# EAGLE design psu (EAGLE 7.6.0)
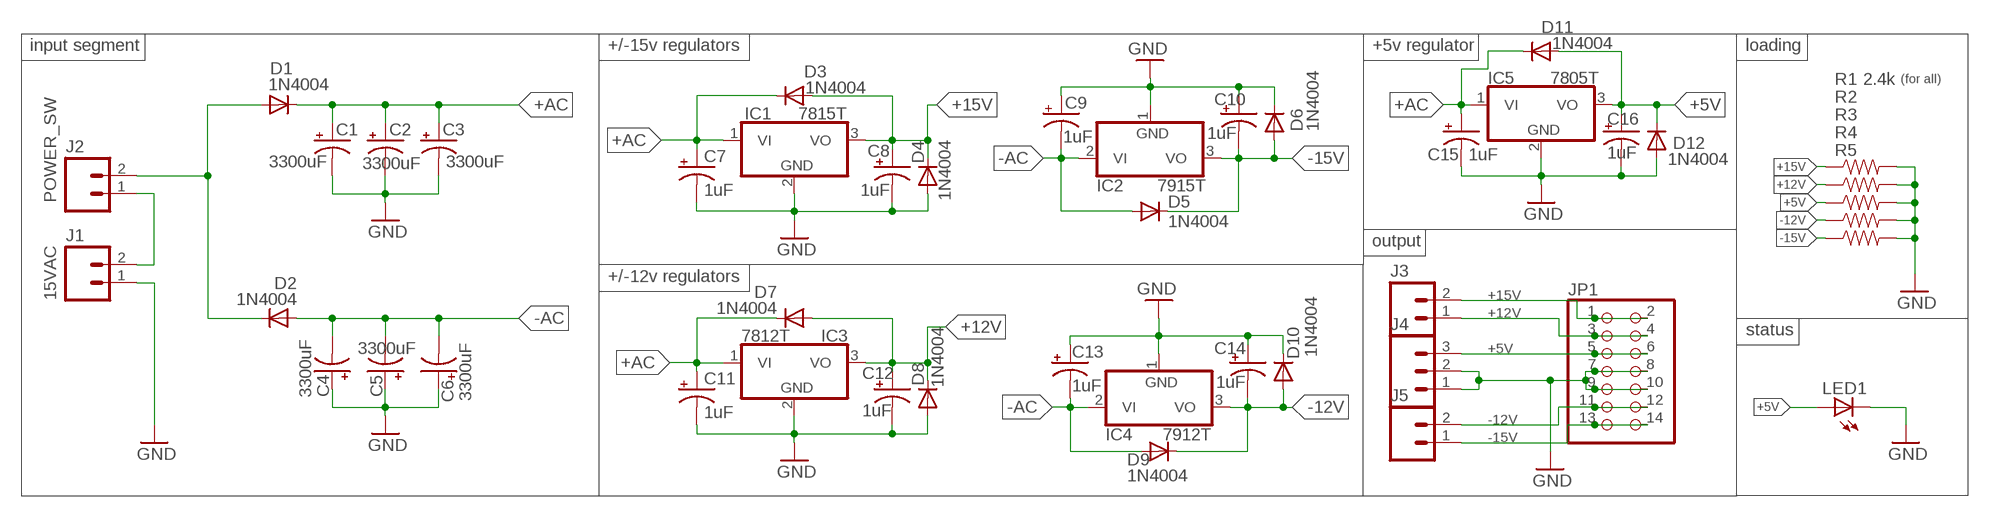
[diagram p0: schematic, sheet 1]

## Parts
C1  3300uF  CPOL-USE7.5-18  [E7,5-18]
C2  3300uF  CPOL-USE7.5-18  [E7,5-18]
C3  3300uF  CPOL-USE7.5-18  [E7,5-18]
C4  3300uF  CPOL-USE7.5-18  [E7,5-18]
C5  3300uF  CPOL-USE7.5-18  [E7,5-18]
C6  3300uF  CPOL-USE7.5-18  [E7,5-18]
C7  1uF  CPOL-USE2.5-5  [E2,5-5]
C8  1uF  CPOL-USE2.5-5  [E2,5-5]
C9  1uF  CPOL-USE2.5-5  [E2,5-5]
C10  1uF  CPOL-USE2.5-5  [E2,5-5]
C11  1uF  CPOL-USE2.5-5  [E2,5-5]
C12  1uF  CPOL-USE2.5-5  [E2,5-5]
C13  1uF  CPOL-USE2.5-5  [E2,5-5]
C14  1uF  CPOL-USE2.5-5  [E2,5-5]
C15  1uF  CPOL-USE2.5-5  [E2,5-5]
C16  1uF  CPOL-USE2.5-5  [E2,5-5]
D1  1N4004  [DO41-10]
D2  1N4004  [DO41-10]
D3  1N4004  [DO41-10]
D4  1N4004  [DO41-10]
D5  1N4004  [DO41-10]
D6  1N4004  [DO41-10]
D7  1N4004  [DO41-10]
D8  1N4004  [DO41-10]
D9  1N4004  [DO41-10]
D10  1N4004  [DO41-10]
D11  1N4004  [DO41-10]
D12  1N4004  [DO41-10]
IC1  7815T  [TO220H]
IC2  7915T  [TO220H]
IC3  7812T  [TO220H]
IC4  7912T  [TO220H]
IC5  7805T  [TO220H]
J1  15VAC  M025MM  [SCREWTERMINAL-5MM-2]
J2  POWER_SW  M025MM  [SCREWTERMINAL-5MM-2]
J3  M025MM  [SCREWTERMINAL-5MM-2]
J4  M03-SCREW-5MM  [SCREWTERMINAL-5MM-3]
J5  M025MM  [SCREWTERMINAL-5MM-2]
JP1  PINHD-2X7  [2X07]
LED1  LED3MM  [LED3MM]
R1  2.4k  RESISTOR0805-RES  [0805]
R2  2.4k  RESISTOR0805-RES  [0805]
R3  2.4k  RESISTOR0805-RES  [0805]
R4  2.4k  RESISTOR0805-RES  [0805]
R5  2.4k  RESISTOR0805-RES  [0805]

## Nets
+5V: C16.+ D11.A D12.C IC5.3(VO) J4.3 JP1.5 JP1.6 LED1.A R3.1
+12V: C12.+ D7.A D8.C IC3.3(VO) J3.1 JP1.3 JP1.4 R2.1
+15V: C8.+ D3.A D4.C IC1.3(VO) J3.2 JP1.1 JP1.2 R1.1
+AC: C1.+ C2.+ C3.+ C7.+ C11.+ C15.+ D1.C D3.C D7.C D11.C IC1.1(VI) IC3.1(VI) IC5.1(VI)
-12V: C14.- D9.C D10.A IC4.3(VO) J5.2 JP1.11 JP1.12 R4.1
-15V: C10.- D5.C D6.A IC2.3(VO) J5.1 JP1.13 JP1.14 R5.1
-AC: C4.- C5.- C6.- C9.- C13.- D2.A D5.A D9.A IC2.2(VI) IC4.2(VI)
GND: C1.- C2.- C3.- C4.+ C5.+ C6.+ C7.- C8.- C9.+ C10.+ C11.- C12.- C13.+ C14.+ C15.- C16.- D4.A D6.C D8.A D10.C D12.A IC1.2(GND) IC2.1(GND) IC3.2(GND) IC4.1(GND) IC5.2(GND) J1.1 J4.1 J4.2 JP1.7 JP1.8 JP1.9 JP1.10 LED1.K(C) R1.2 R2.2 R3.2 R4.2 R5.2
N$1: J1.2 J2.1
N$2: D1.A D2.C J2.2

## Notes on the sheet
- input segment | +/-15v regulators | +5v regulator | loading
- (for all)
- output
- +/-12v regulators
- status

## Library data of the parts
C1-C16 = resistor:CPOL-US: POLARIZED CAPACITOR, American symbol
D1-D12 = diode:1N4004: DIODE general purpose rectifier, 1 A
IC1 IC3 IC5 = linear:78*: Positive VOLTAGE REGULATOR Source: http://cache.national.com/ds/LM/LM78L05.pdf http://www.fairchildsemi.com/ds/LM/LM7805.pdf
IC2 IC4 = linear:79*: Negative VOLTAGE REGULATOR
J1-J3 J5 = SparkFun-Connectors:M02: Standard 2-pin 0.1" header. Use with - straight break away headers ( PRT-00116) - right angle break away headers (PRT-00553) - swiss pins (PRT-00743) - machine pins (PRT-00117) - female headers (PRT-00115) Molex polarized connector foot print use with: PRT-08233 with associated crimp pins and housings. 2.54_SCREWTERM for use with PRT-10571. 3.5mm Screw Terminal footprints for PRT-08084 5mm Screw Terminal footprints for use with PRT-08432; STOREFRONT_ID: PRT-08432
J4 = SparkFun-Connectors:M03: Header 3 Standard 3-pin 0.1" header. Use with straight break away headers (SKU : PRT-00116), right angle break away headers (PRT-00553), swiss pins (PRT-00743), machine pins (PRT-00117), and female headers (PRT-00115). Molex polarized connector foot print use with SKU : PRT-08232 with associated crimp pins and housings.; STOREFRONT_ID: PRT-08433
JP1 = pinhead:PINHD-2X7: PIN HEADER
LED1 = led:LED: LED OSRAM: - CHIPLED LG R971, LG N971, LY N971, LG Q971, LY Q971, LO R971, LY R971 LH N974, LH R974 LS Q976, LO Q976, LY Q976 LO Q996 - Hyper CHIPLED LW Q18S LB Q993, LB Q99A, LB R99A - SideLED LS A670, LO A670, LY A670, LG A670, LP A670 LB A673, LV A673, LT A673, LW A673 LH A674 LY A675 LS A676, LA A676, LO A676, LY A676, LW A676 LS A679, LY A679, LG A679 - Hyper Micro SIDELED® LS Y876, LA Y876, LO Y876, LY Y876 LT Y87S - SmartLED LW L88C, LW L88S LB L89C, LB L89S, LG L890 LS L89K, LO L89K, LY L89K LS L896, LA L896, LO L896, LY L896 - TOPLED LS T670, LO T670, LY T670, LG T670, LP T670 LSG T670, LSP T670, LSY T670, LOP T670, LYG T670 LG T671, LOG T671, LSG T671 LB T673, LV T673, LT T673, LW T673 LH T674 LS T676, LA T676, LO T676, LY T676, LB T676, LH T676, LSB T676, LW T676 LB T67C, LV T67C, LT T67C, LS T67K, LO T67K, LY T67K, LW E67C LS E67B, LA E67B, LO E67B, LY E67B, LB E67C, LV E67C, LT E67C LW T67C LS T679, LY T679, LG T679 LS T770, LO T770, LY T770, LG T770, LP T770 LB T773, LV T773, LT T773, LW T773 LH T774 LS E675, LA E675, LY E675, LS T675 LS T776, LA T776, LO T776, LY T776, LB T776 LHGB T686 LT T68C, LB T68C - Hyper Mini TOPLED® LB M676 - Mini TOPLED Santana® LG M470 LS M47K, LO M47K, LY M47K Source: http://www.osram.convergy.de LUXEON: - LUMILED® LXK2-PW12-R00, LXK2-PW12-S00, LXK2-PW14-U00, LXK2-PW14-V00 LXK2-PM12-R00, LXK2-PM12-S00, LXK2-PM14-U00 LXK2-PE12-Q00, LXK2-PE12-R00, LXK2-PE12-S00, LXK2-PE14-T00, LXK2-PE14-U00 LXK2-PB12-K00, LXK2-PB12-L00, LXK2-PB12-M00, LXK2-PB14-N00, LXK2-PB14-P00, LXK2-PB14-Q00 LXK2-PR12-L00, LXK2-PR12-M00, LXK2-PR14-Q00, LXK2-PR14-R00 LXK2-PD12-Q00, LXK2-PD12-R00, LXK2-PD12-S00 LXK2-PH12-R00, LXK2-PH12-S00 LXK2-PL12-P00, LXK2-PL12-Q00, LXK2-PL12-R00 Source: www.luxeon.com KINGBRIGHT: KA-3528ASYC Source: www.kingbright.com
R1-R5 = SparkFun-Resistors:RESISTOR: Resistor Basic schematic elements and footprints for 0603, 1206, and PTH resistors.

## Board
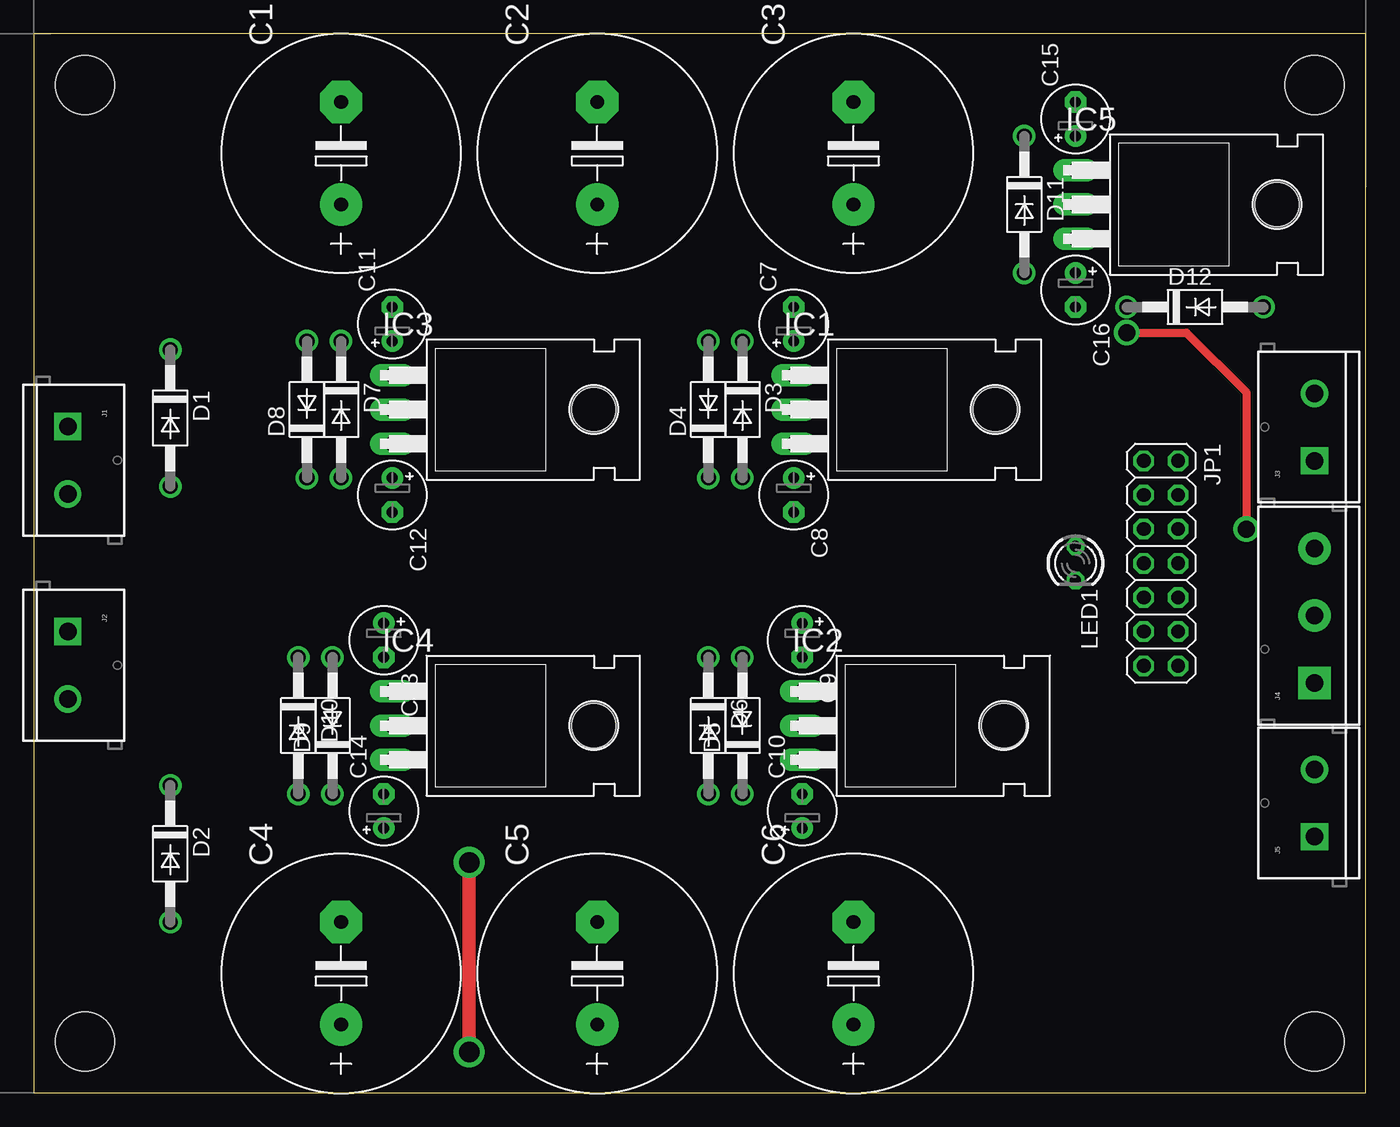
[diagram p1: board, top side]
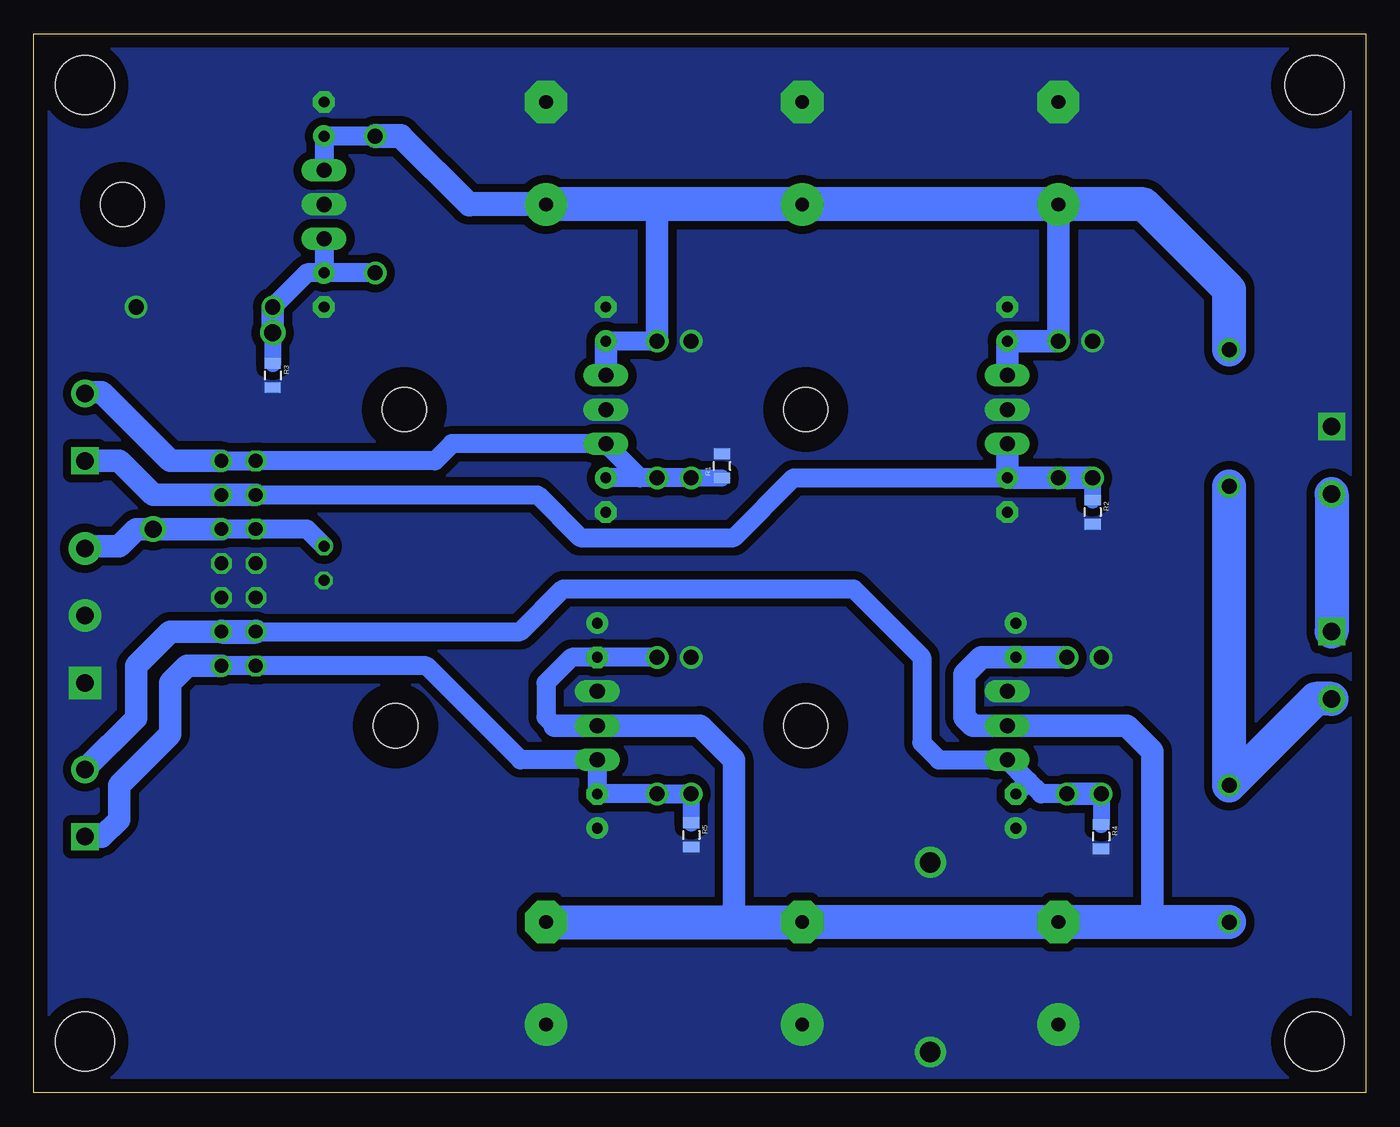
[diagram p2: board, bottom side, seen from below]

Size 99.06 x 78.74 mm. Coordinates in mm from the lower left corner, seen from the top.
Outline: 0,0 99.06,0 99.06,78.74 0,78.74 0,0
Copper layers (1*16): Top 0.035mm / dielectric 1.5mm / Bottom 0.035mm
Design rules "default": minimum track width 10mil, minimum drill 24mil, track to track 8mil, track to pad 8mil, pad to pad 8mil, via to via 8mil, smd to smd 8mil, copper to edge 40mil, drill to drill 8mil, minimum pad ring 10mil, minimum via ring 8mil, stop-mask expansion 4mil, vias tented up to drill 0mil, thermal gap 10mil
Holes 4.4 mm at 3.81,3.81 3.81,74.93 95.25,74.93 95.25,3.81

### Footprints (pad centres in the part's own frame; a part is rotated, then mirrored left to right if it is on the bottom)
E7,5-18 = drill 1.016 pad 3.15: + -3.81,0 | drill 1.016 pad 3.15 octagon: - 3.81,0
E2,5-5 = drill 0.813 pad 1.6: + -1.27,0 | drill 0.813 pad 1.6 octagon: - 1.27,0
DO41-10 = drill 1.118: A 5.08,0; C -5.08,0
TO220H = drill 1.118 long: 1 -2.54,-10.16; 2 0,-10.16; 3 2.54,-10.16 | hole 3.302: 0,4.826
SCREWTERMINAL-5MM-2 = drill 1.3 pad 2.032 square: 1 0,0 | drill 1.3 pad 2.032: 2 5,0
SCREWTERMINAL-5MM-3 = drill 1.3 pad 2.413 square: 1 0,0 | drill 1.3 pad 2.413: 2 5,0; 3 10,0
2X07 = drill 1.016 octagon: 1 -7.62,-1.27; 2 -7.62,1.27; 3 -5.08,-1.27; 4 -5.08,1.27; 5 -2.54,-1.27; 6 -2.54,1.27; 7 0,-1.27; 8 0,1.27; 9 2.54,-1.27; 10 2.54,1.27; 11 5.08,-1.27; 12 5.08,1.27; 13 7.62,-1.27; 14 7.62,1.27
LED3MM = drill 0.813 octagon: A -1.27,0; K 1.27,0
0805 = smd 0.8 x 1.2: 1 -0.9,0; 2 0.9,0

### Placement (x,y rotation side)
C1  22.86,69.85 90 top
C2  41.91,69.85 90 top
C3  60.96,69.85 90 top
C4  22.86,8.89 90 top
C5  41.91,8.89 90 top
C6  60.96,8.89 90 top
C7  56.52,57.15 90 top
C8  56.52,44.45 270 top
C9  57.15,33.66 270 top
C10  57.15,20.95 90 top
C11  26.67,57.15 90 top
C12  26.67,44.45 270 top
C13  26.04,33.66 270 top
C14  26.04,20.95 90 top
C15  77.47,72.39 90 top
C16  77.47,59.69 270 top
D1  10.16,50.16 270 top
D2  10.16,17.78 270 top
D3  52.7,50.8 270 top
D4  50.16,50.8 90 top
D5  52.7,27.3 90 top
D6  50.16,27.3 270 top
D7  22.86,50.8 270 top
D8  20.32,50.8 90 top
D9  22.23,27.3 90 top
D10  19.68,27.3 270 top
D11  73.66,66.04 270 top
D12  86.36,58.42 0 top
IC1  66.67,50.8 270 top
IC2  67.31,27.3 270 top
IC3  36.83,50.8 270 top
IC4  36.83,27.3 270 top
IC5  87.63,66.04 270 top
J1  2.54,49.53 270 top
J2  2.54,34.29 270 top
J3  95.25,46.99 90 top
J4  95.25,30.48 90 top
J5  95.25,19.05 90 top
JP1  83.82,39.37 270 top
LED1  77.47,39.37 270 top
R1  47.88,46.61 90 bottom
R2  20.32,43.18 270 bottom
R3  81.28,53.34 270 bottom
R4  19.68,19.05 270 bottom
R5  50.16,19.18 270 bottom

### Tracks (layer width: path | path; a pad name or v marks a point on that pad's centre or on a via)
+5V  (via drill 1.27)
  Top 0.61: v81.28,56.52 85.72,56.52 90.17,52.07 v90.17,41.91
  Bottom 1.27: v81.28,56.52 R3.1
  Bottom 1.422: D11.A C16.+ | C16.+ 78.74,60.96 D12.C | JP1.6 JP1.5 78.74,41.91 LED1.A | IC5.3 C16.+
  Bottom 1.676: JP1.6 v90.17,41.91 91.44,41.91 92.71,40.64 95.09,40.64 J4.3 | D12.C v81.28,56.52
+12V
  Bottom 1.27: D8.C R2.1
  Bottom 1.422: JP1.3 61.59,44.45 58.42,41.27 46.99,41.27 42.55,45.72 26.04,45.72
  Bottom 1.676: D8.C D7.A 26.04,45.72 C12.+ IC3.3 | J3.1 92.71,46.99 90.17,44.45 JP1.4 JP1.3
+15V
  Bottom 1.27: D4.C R1.1
  Bottom 1.422: JP1.2 JP1.1 69.22,46.99 67.94,48.26 IC1.3 53.98,45.72 | 53.98,45.72 D3.A D4.C | 53.98,45.72 C8.+
  Bottom 1.676: JP1.2 88.9,46.99 93.98,52.07 95.17,52.07 J3.2
+AC
  Bottom 1.422: D3.C C7.+ | D11.C C15.+ IC5.1
  Bottom 1.676: IC1.1 C7.+ | IC3.1 C11.+ D7.C C1.+ | C3.+ 53.34,66.04 52.7,65.41 D3.C
  Bottom 1.778: C3.+ 66.67,66.04 71.75,71.12 D11.C
  Bottom 2.54: C3.+ C2.+ C1.+ 16.51,66.04 10.16,59.69 D1.C
-12V
  Bottom 1.27: D10.A R4.1
  Bottom 1.422: D9.C 24.13,22.23 25.08,23.18 | 25.08,23.18 IC4.3 31.75,24.77 33.02,26.04 33.02,32.38 38.1,37.47 59.69,37.47 62.87,34.29 JP1.11 | C14.- 25.08,23.18
  Bottom 1.676: D10.A D9.C | JP1.12 88.9,34.29 91.44,31.75 91.44,27.86 J5.2
  Bottom 1.778: JP1.12 JP1.11
-15V
  Bottom 1.27: D6.A R5.1
  Bottom 1.422: JP1.14 JP1.13 69.85,31.75 62.87,24.77 IC2.3 C10.- D5.C D6.A
  Bottom 1.676: JP1.14 87.63,31.75 88.9,30.48 88.9,26.67 92.71,22.86 92.71,20.32 93.98,19.05 J5.1
-AC
  Bottom 0.254: C13.- 25.4,33.02
  Bottom 1.422: D5.A C9.- 59.05,32.38 60.96,30.48 60.96,27.94 60.33,27.3 IC2.2
  Bottom 1.676: D9.A C13.- 28.57,32.38 29.84,31.11 29.84,27.94 29.21,27.3 IC4.2 17.78,27.3 15.88,25.4 15.88,13.34 15.24,12.7 | 60.33,27.3 49.53,27.3 46.99,24.77 46.99,13.34 47.62,12.7
  Bottom 2.54: D2.A 15.24,12.7 C4.- C5.- 47.62,12.7 C6.-
GND  (via drill 1.52)
  Top 1.016: v32.38,17.14 v32.38,3.05
  pour Bottom (isolate 0.61, no thermals): -6.35,83.82 -6.35,-3.81 110.49,-3.81 110.49,83.82
N$1
  Bottom 2.54: J1.2 J2.1
N$2
  Bottom 2.54: J2.2 3.73,29.29 D2.C D1.A